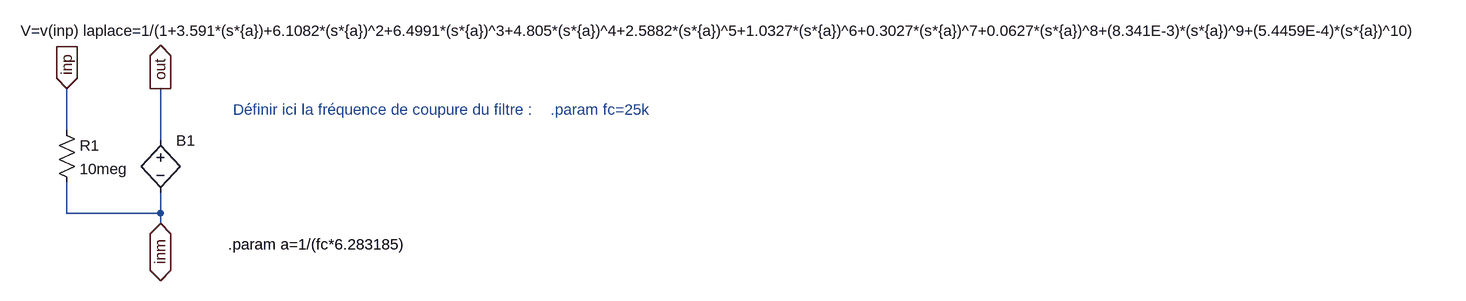
[diagram p0: schematic 10th_Bessel_LPfilter.asc]
10th_Bessel_LPfilter.asc, the LTspice schematic file:
Version 4
SHEET 1 880 680
WIRE -2288 -128 -2288 -192
WIRE -2144 -112 -2144 -192
WIRE -2288 0 -2288 -48
WIRE -2144 0 -2144 -32
WIRE -2144 0 -2288 0
WIRE -2144 16 -2144 0
FLAG -2144 -192 out
IOPIN -2144 -192 Out
FLAG -2288 -192 inp
IOPIN -2288 -192 In
FLAG -2144 16 inm
IOPIN -2144 16 BiDir
SYMBOL bv -2144 -128 R0
WINDOW 3 -215 -153 Left 0
SYMATTR Value V=v(inp) laplace=1/(1+3.591*(s*{a})+6.1082*(s*{a})^2+6.4991*(s*{a})^3+4.805*(s*{a})^4+2.5882*(s*{a})^5+1.0327*(s*{a})^6+0.3027*(s*{a})^7+0.0627*(s*{a})^8+(8.341E-3)*(s*{a})^9+(5.4459E-4)*(s*{a})^10)
SYMATTR InstName B1
SYMBOL res -2304 -144 R0
SYMATTR InstName R1
SYMATTR Value 10meg
TEXT -2040 48 Left 0 !.param a=1/(fc*6.283185)
TEXT -1544 -160 Left 0 ;.param fc=25k
TEXT -2032 -160 Left 0 ;Définir ici la fréquence de coupure du filtre :

The netlist it stands for:
* 10th_Bessel_LPfilter.asc
B1 out inm V=v(inp) laplace=1/(1+3.591*(s*{a})+6.1082*(s*{a})^2+6.4991*(s*{a})^3+4.805*(s*{a})^4+2.5882*(s*{a})^5+1.0327*(s*{a})^6+0.3027*(s*{a})^7+0.0627*(s*{a})^8+(8.341E-3)*(s*{a})^9+(5.4459E-4)*(s*{a})^10)
R1 inp inm 10meg
.param a=1/(fc*6.283185)
* .param fc=25k
* Définir ici la fréquence de coupure du filtre :
.backanno
.end